# Altium schematic sheet SingEndOutput.SchDoc: AC Coupled Output Schematic
size A; DrawnBy: Enrique Morell; DocumentNumber: 9; Revision: v0.1; SheetNumber: 9; SheetTotal: 9
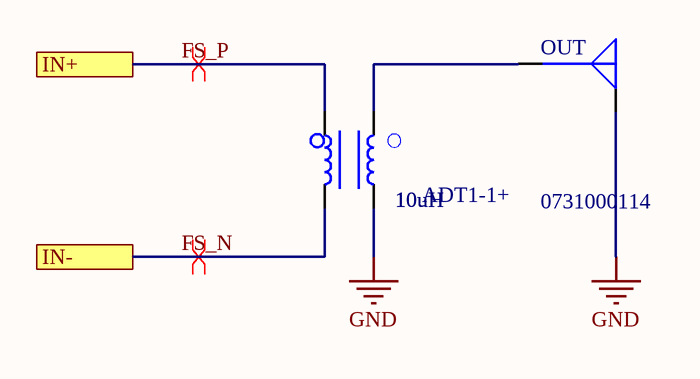
[diagram p0: SingEndOutput.SchDoc]

## Parts
OUT  0731000114  [MOLEX SD-73100-0114]
XRF  ADT1-1+  Inductance A: 10uH  Coupling Factor: 1  [ADT1-1+]

## Ports
IN+, IN-

## Nets
GND: OUT.G XRF.6
FS_N: XRF.1 ; port IN-
FS_P: XRF.3 ; port IN+
NetOUT_S: OUT.S XRF.4

## Layout directives
differential pair: FS_N, FS_P

## Library data of the parts
OUT = 0731000114: CONN SMA RCPT R/A 50 OHM PCB; Manufacturer: Molex; Impedance: 50 Ohm; Body Finish: Gold; Body Material: Brass; Contact Termination: Solder; Dielectric Material: Polytetrafluoroethylene (PTFE); Voltage Rating: 500V; Center Contact Material: Gold; Center Contact Plating: Gold; ComponentLink1Description: Datasheet; ComponentLink1URL: https://www.molex.com/pdm_docs/sd/731000114_sd.pdf; ComponentLink2Description: Digi-Key Listing; ComponentLink2URL: https://www.digikey.com/product-detail/en/molex/0731000114/WM5525-ND/1465147; Fastening Type: Threaded; Housing Colour: Gold; Mounting Type: Through Hole, Right Angle; Operating Temperature: -65°C ~ 165°C; PartId: 16436; Part Number: 0731000114; Price: 5.14; Series: 73100; Shield Termination: Solder; Style: SMA; Supplier 1: Digi-Key; Supplier Part Number 1: WM5525-ND; Type: Receptacle, Female Socket
XRF = ADT1-1+: RF XFMR 50Ohm / SURF MOUNT / RoHS; Manufacturer: Mini-Circuits; Part Number: ADT1-1+; PartId: 21136; Supplier 1: Mini-Circuits; Supplier Part Number 1: ADT1-1+; ComponentLink1Description: Datasheet; ComponentLink1URL: https://www.minicircuits.com/pdfs/ADT1-1+.pdf; ComponentLink2Description: Mini-Circuit Listing; ComponentLink2URL: https://www.minicircuits.com/WebStore/dashboard.html?model=ADT1-1%2B; Inductance B: 10uH